# Altium schematic sheet Sheet2.SchDoc
size A1
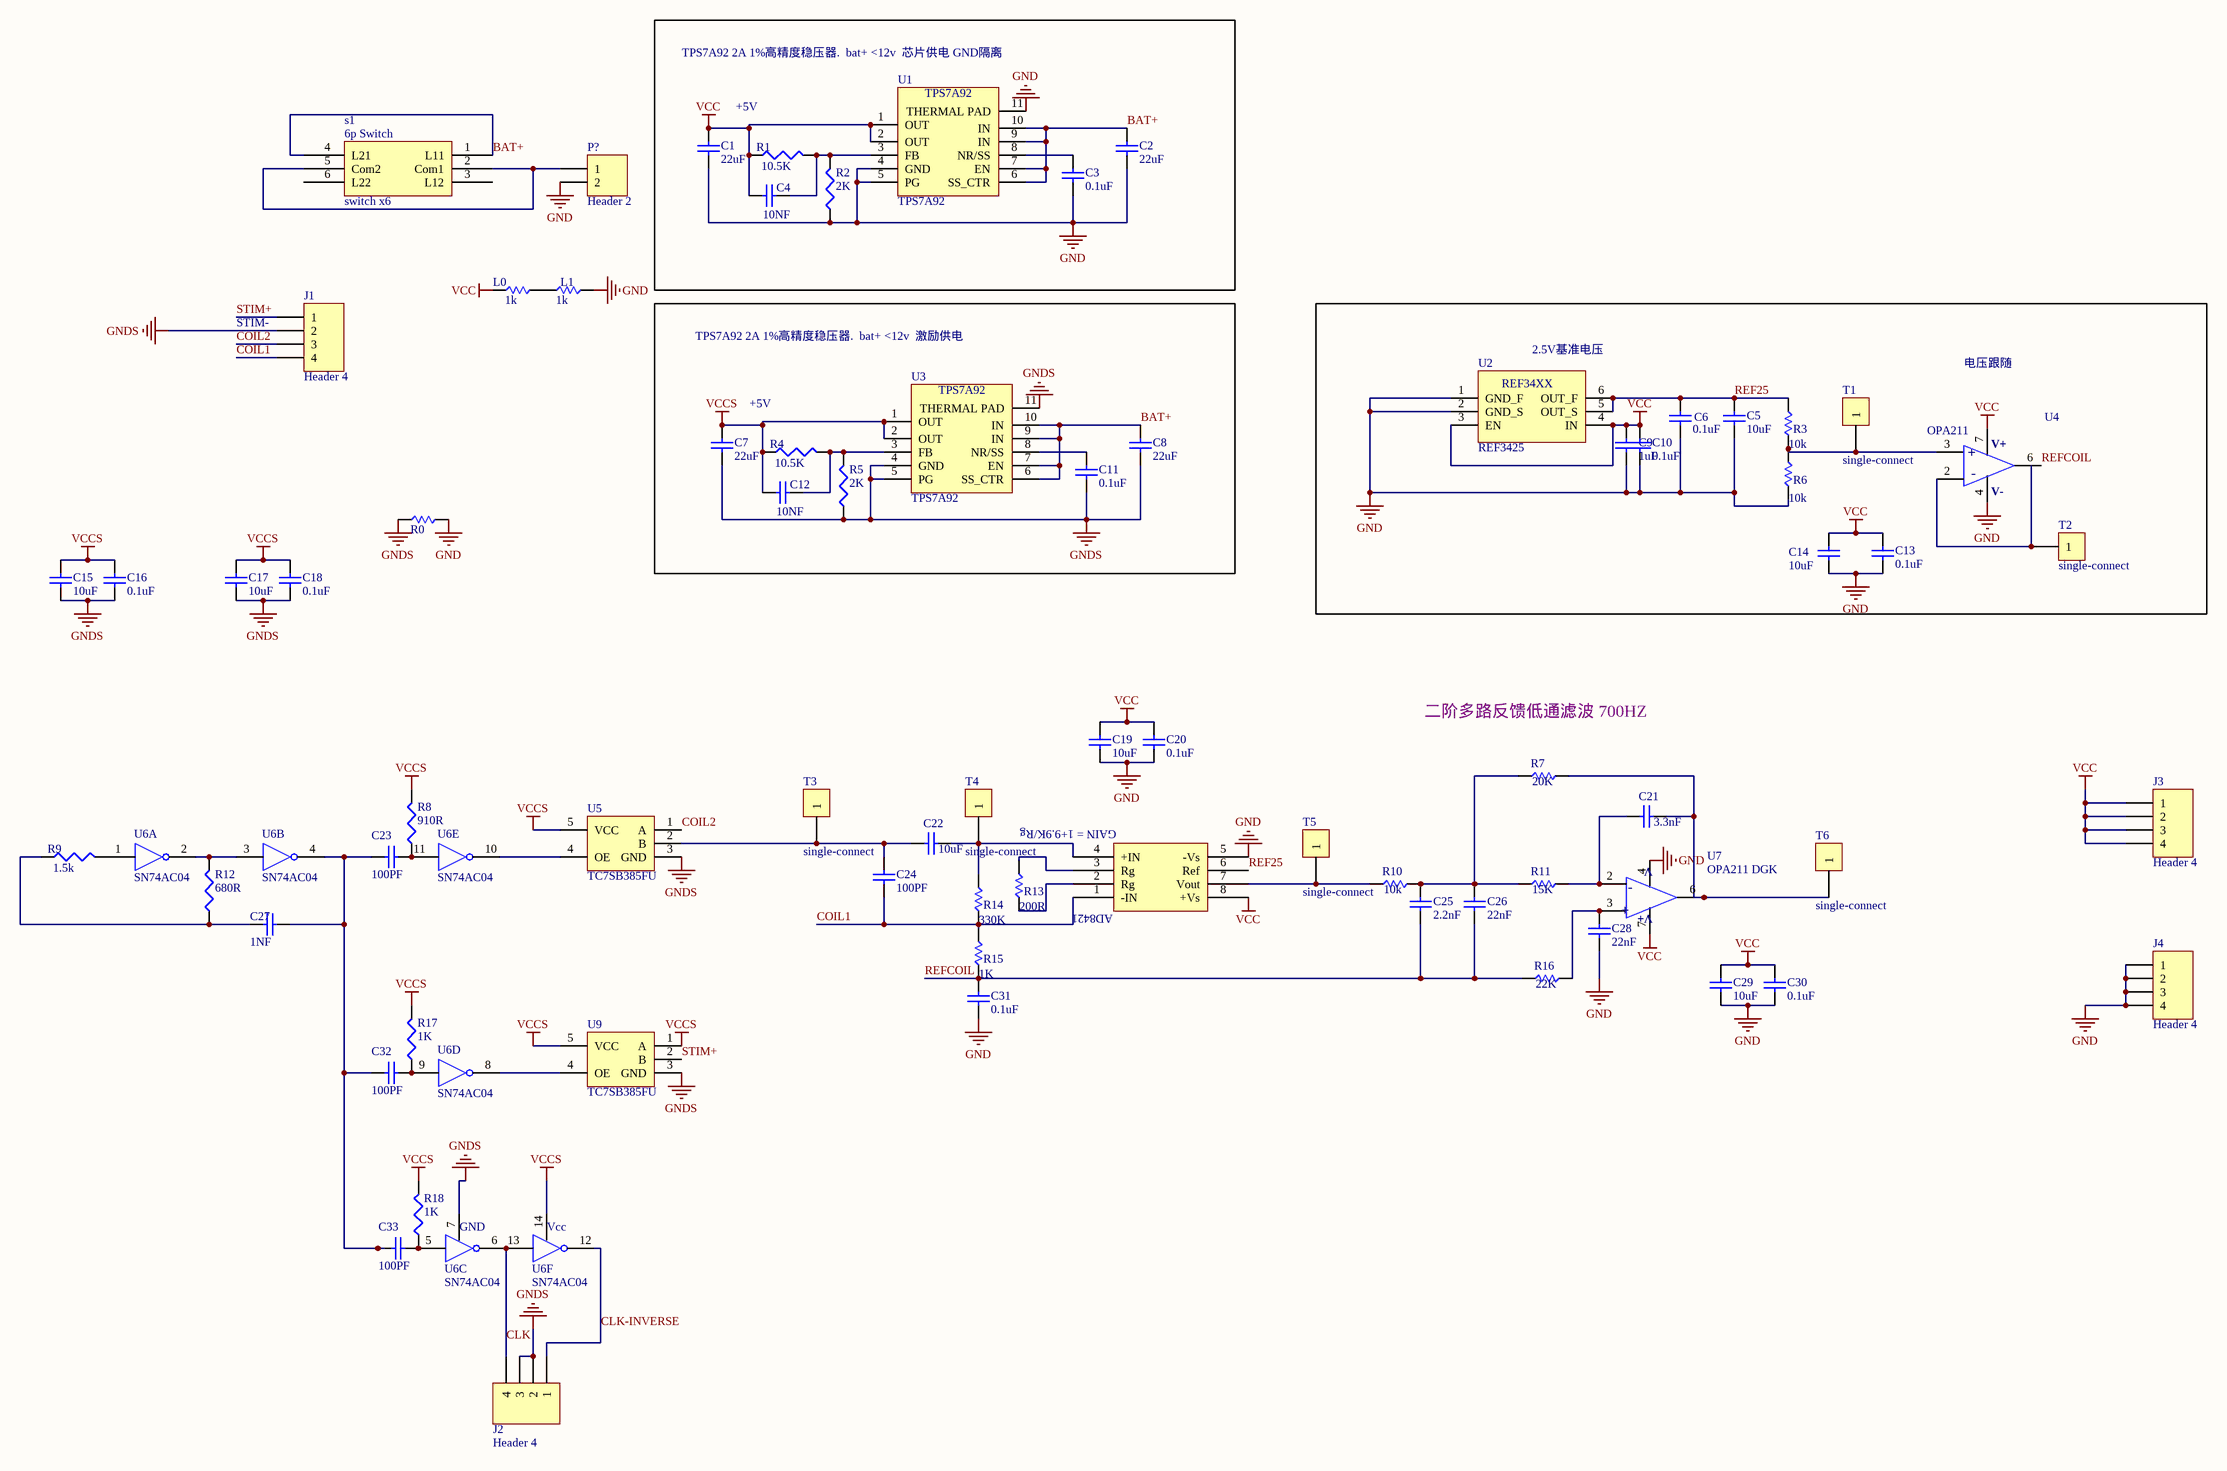
[diagram p0: Sheet2.SchDoc]

## Parts
C1  cap0603  [cap0603]  (value not drawn)
C2  cap0603  [cap0603]  (value not drawn)
C3  cap0603  [cap0603]  (value not drawn)
C4  cap0603  [cap0603]  (value not drawn)
C5  cap0603  [cap0603]  (value not drawn)
C6  cap0603  [cap0603]  (value not drawn)
C7  cap0603  [cap0603]  (value not drawn)
C8  cap0603  [cap0603]  (value not drawn)
C9  cap0603  [cap0603]  (value not drawn)
C10  cap0603  [cap0603]  (value not drawn)
C11  cap0603  [cap0603]  (value not drawn)
C12  cap0603  [cap0603]  (value not drawn)
C13  cap0603  [cap0603]  (value not drawn)
C14  cap0603  [cap0603]  (value not drawn)
C15  cap0603  [cap0603]  (value not drawn)
C16  cap0603  [cap0603]  (value not drawn)
C17  cap0603  [cap0603]  (value not drawn)
C18  cap0603  [cap0603]  (value not drawn)
C19  cap0603  [cap0603]  (value not drawn)
C20  cap0603  [cap0603]  (value not drawn)
C21  cap0603  [cap0603]  (value not drawn)
C22  cap0603  [cap0603]  (value not drawn)
C23  cap0603  [cap0603]  (value not drawn)
C24  cap0603  [cap0603]  (value not drawn)
C25  cap0603  [cap0603]  (value not drawn)
C26  cap0603  [cap0603]  (value not drawn)
C27  cap0603  [cap0603]  (value not drawn)
C28  cap0603  [cap0603]  (value not drawn)
C29  cap0603  [cap0603]  (value not drawn)
C30  cap0603  [cap0603]  (value not drawn)
C31  cap0603  [cap0603]  (value not drawn)
C32  cap0603  [cap0603]  (value not drawn)
C33  cap0603  [cap0603]  (value not drawn)
J1  Header 4  [HDR1X4]
J2  Header 4  [HDR1X4]
J3  Header 4  [HDR1X4]
J4  Header 4  [HDR1X4]
L0  R  [res0402]  (value not drawn)
L1  R  [res0402]  (value not drawn)
P?  Header 2  [HDR1X2]
R0  res0603  [res0603]  (value not drawn)
R1  res0603  [res0603]  (value not drawn)
R2  res0603  [res0603]  (value not drawn)
R3  res0603  [res0603]  (value not drawn)
R4  res0603  [res0603]  (value not drawn)
R5  res0603  [res0603]  (value not drawn)
R6  res0603  [res0603]  (value not drawn)
R7  res0603  [res0603]  (value not drawn)
R8  res0603  [res0603]  (value not drawn)
R9  res0603  [res0603]  (value not drawn)
R10  res0603  [res0603]  (value not drawn)
R11  res0603  [res0603]  (value not drawn)
R12  res0603  [res0603]  (value not drawn)
R13  res0603  [res0603]  (value not drawn)
R14  res0603  [res0603]  (value not drawn)
R15  res0603  [res0603]  (value not drawn)
R16  res0603  [res0603]  (value not drawn)
R17  res0603  [res0603]  (value not drawn)
R18  res0603  [res0603]  (value not drawn)
s1  switch x6  [6p Switch]
T1  single-connect  [single-connect]
T2  single-connect  [single-connect]
T3  single-connect  [single-connect]
T4  single-connect  [single-connect]
T5  single-connect  [single-connect]
T6  single-connect  [single-connect]
U1  TPS7A92  [TPS7A92]
U2  REF3425  [REF34XX]
U3  TPS7A92  [TPS7A92]
U4  OPA211 DGK  [OPA211 DGK]  (value not drawn)
U5  TC7SB385FU  [TC7SB385FU]
U6  SN74AC04  [SN74AC04 PW(R-PSDO-G14)]  (parts A,B,C,D,E,F of 6)
U7  OPA211 DGK  [OPA211 DGK]
U8  AD8421  [AD8421]  (value not drawn)
U9  TC7SB385FU  [TC7SB385FU]

## Nets
GND: C1.1 C2.1 C3.1 C5.1 C6.1 C9.1 C10.1 C13.1 C14.1 C19.1 C20.1 C28.1 C29.1 C30.1 C31.1 J4.1 J4.2 J4.3 J4.4 L1.2 P?.2 R0.2 R2.1 R6.1 U1.4(GND) U1.5(PG) U1.11(THERMAL_PAD) U2.1(GND_F) U2.2(GND_S) U4.4(V-) U7.4(V-) U8.5(-Vs)
GNDS: C7.1 C8.1 C11.1 C15.1 C16.1 C17.1 C18.1 J1.2 J2.2 J2.3 R0.1 R5.1 U3.4(GND) U3.5(PG) U3.11(THERMAL_PAD) U5.3(GND) U6.7(GND) U9.3(GND)
VCC: C1.2 C4.2 C9.2 C10.2 C13.2 C14.2 C19.2 C20.2 C29.2 C30.2 J3.1 J3.2 J3.3 J3.4 L0.1 R1.1 U1.1(OUT) U1.2(OUT) U2.3(EN) U2.4(IN) U4.7(V+) U7.7(V+) U8.8(+Vs)
VCCS: C7.2 C12.2 C15.2 C16.2 C17.2 C18.2 R4.1 R8.2 R17.2 R18.2 U3.1(OUT) U3.2(OUT) U5.5(VCC) U6.14(VCC) U9.1(A) U9.5(VCC)
BAT+: C2.2 C8.2 s1.1(L11) s1.4(L21) U1.6(SS_CTR) U1.7(EN) U1.9(IN) U1.10(IN) U3.6(SS_CTR) U3.7(EN) U3.9(IN) U3.10(IN)
CLK: J2.4 U6.6 U6.13
CLK-INVERSE: J2.1 U6.12
COIL1: C24.1 J1.4 R14.1 R15.2 U8.1(-IN)
COIL2: J1.3 U5.1(A)
REF25: C5.2 C6.2 R3.2 U2.5(OUT_S) U2.6(OUT_F) U8.6(Ref)
REFCOIL: C25.1 C26.1 C31.2 R15.1 R16.2 U4.6(OUT)
STIM+: J1.1 U9.2(B)
NetC3_2: C3.2 U1.8(NR/SS)
NetC4_1: C4.1 R1.2 R2.2 U1.3(FB)
NetC11_2: C11.2 U3.8(NR/SS)
NetC12_1: C12.1 R4.2 R5.2 U3.3(FB)
NetC21_1: C21.1 R7.1 T6.1 U7.6(OUT)
NetC21_2: C21.2 R11.1 U7.2(-IN)
NetC22_1: C22.1 R14.2 T4.1 U8.4(+IN)
NetC22_2: C22.2 C24.2 T3.1 U5.2(B)
NetC23_1: C23.1 C27.2 C32.1 C33.1 U6.4
NetC23_2: C23.2 R8.1 U6.11
NetC25_2: C25.2 C26.2 R7.2 R10.1 R11.2
NetC27_1: C27.1 R9.1 R12.1
NetC28_2: C28.2 R16.1 U7.3(+IN)
NetC32_2: C32.2 R17.1 U6.9
NetC33_2: C33.2 R18.1 U6.5
NetL0_2: L0.2 L1.1
NetP?_1: P?.1 s1.2(Com1) s1.5(Com2)
NetR3_1: R3.1 R6.2 T1.1 U4.3(+IN)
NetR9_2: R9.2 U6.1
NetR10_2: R10.2 T5.1 U8.7(Vout)
NetR12_2: R12.2 U6.2 U6.3
NetR13_1: R13.1 U8.2(Rg)
NetR13_2: R13.2 U8.3(Rg)
NetT2_1: T2.1 U4.2(-IN)
NetU5_4: U5.4(OE) U6.10
NetU6_8: U6.8 U9.4(OE)

Not connected (* = marked no-connect by the designer): s1 3(L12) 6(L22)

## Notes on the sheet
- (near U1) TPS7A92 2A 1%高精度稳压器.  bat+ <12v  芯片供电 GND隔离
- +5V
- (near J1) STIM-
- TPS7A92 2A 1%高精度稳压器.  bat+ <12v  激励供电
- (near U2) 2.5V基准电压
- 电压跟随
- 二阶多路反馈低通滤波 700HZ
- (in symbol AD8421) GAIN = 1+9.9K/Rg
- (in symbol cap0603) 1NF; 100PF; 1uF; 10uF; 0.1uF; 22nF; 2.2nF; 3.3nF; 22uF; 10NF
- (in symbol OPA211 DGK) OPA211; +; -
- (in symbol res0402) 1k
- (in symbol res0603) 1.5k; 680R; 910R; 1K; 10.5K; 2K; 10k; 330K; 200R; 15K; 20K; 22K
- (in symbol SN74AC04, part F) Vcc
- (in symbol switch x6) 6p Switch

## Library data of the parts
J1-J4 = Header 4: Header, 4-Pin; LatestRevisionDate: 17-Jul-2002; LatestRevisionNote: Re-released for DXP Platform.; Publisher: Altium Limited
L0 L1 = res0402
P? = Header 2: Header, 2-Pin; LatestRevisionDate: 17-Jul-2002; LatestRevisionNote: Re-released for DXP Platform.; Publisher: Altium Limited
U2 = REF34XX